# Altium schematic sheet cm_filter_ch1_a.SchDoc: Common Mode Filter CH1 A
size A4; Date: 2015-02-21; Author: Piotr Kuligowski; Revision: 1-0; SheetTotal: 14; Model: EM1
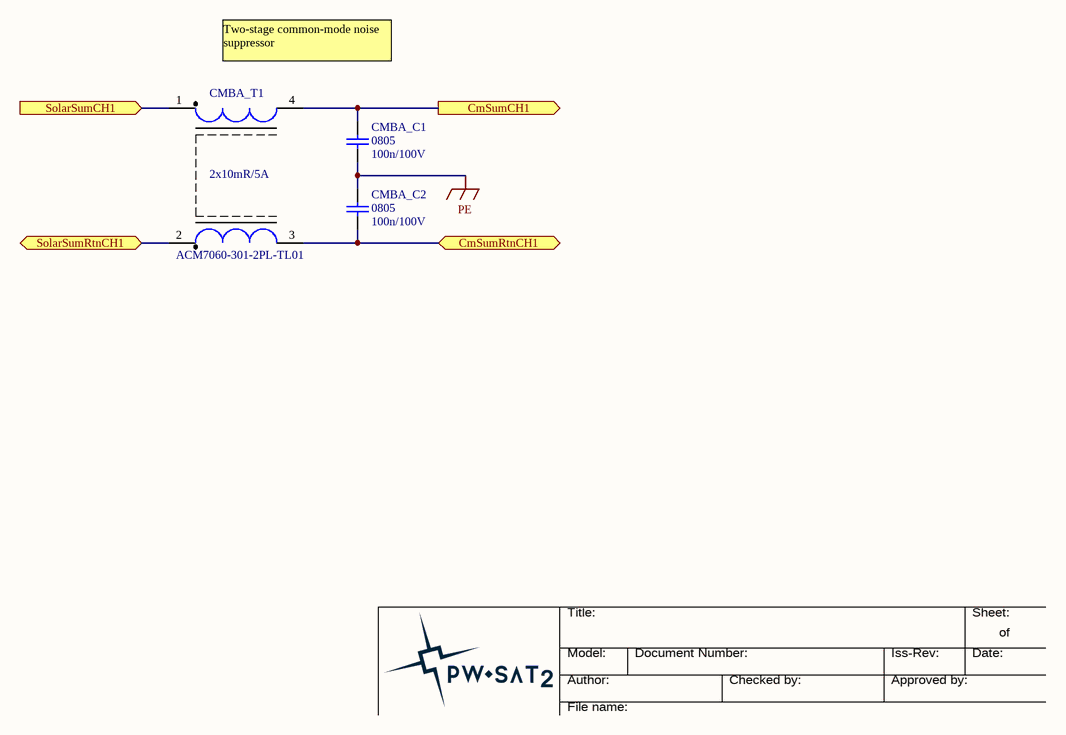
[diagram p0: cm_filter_ch1_a.SchDoc]

## Parts
CMBA_C1  Package: 0805  [SMD_Capacitor_0805]  (hidden comment: 100n/100V)
CMBA_C2  Package: 0805  [SMD_Capacitor_0805]  (hidden comment: 100n/100V)
CMBA_T1  2x10mR/5A  [TDK_ACM7060]

## Ports
CmSumCH1 (out), CmSumRtnCH1, SolarSumCH1 (in), SolarSumRtnCH1

## Nets
PE: CMBA_C1.2 CMBA_C2.1
CmSumCH1: CMBA_C1.1 CMBA_T1.4 ; port CmSumCH1
CmSumRtnCH1: CMBA_C2.2 CMBA_T1.3 ; port CmSumRtnCH1
SolarSumCH1: CMBA_T1.1 ; port SolarSumCH1
SolarSumRtnCH1: CMBA_T1.2 ; port SolarSumRtnCH1

## Notes on the sheet
- Two-stage common-mode noise suppressor
- Title:
- Sheet:
- of
- Author:
- Model:
- Document Number:
- Checked by:
- Iss-Rev:
- Approved by:
- Date:
- File name:

## Library data of the parts
CMBA_C1 CMBA_C2 = Cer_C0805T104K1RCLTU: Ceramic Cap Kemet COTS 100n/100V X7R 0805; ManufacturerPartNumber: C0805T104K1RCLTU; Manufacturer: Kemet; Value: 100n/100V
CMBA_T1 = ACM7060-301-2PL-TL01: TDK ACM7060-301 Common Mode Choke; Manufacturer: TDK; ManufacturerPartNumber: ACM7060-301-2PL-TL01; Value: 2x10mR/5A